# Altium schematic sheet [04] - RADIO.SchDoc
size A3; DocumentNumber: 4; SheetNumber: 4; SheetTotal: 8
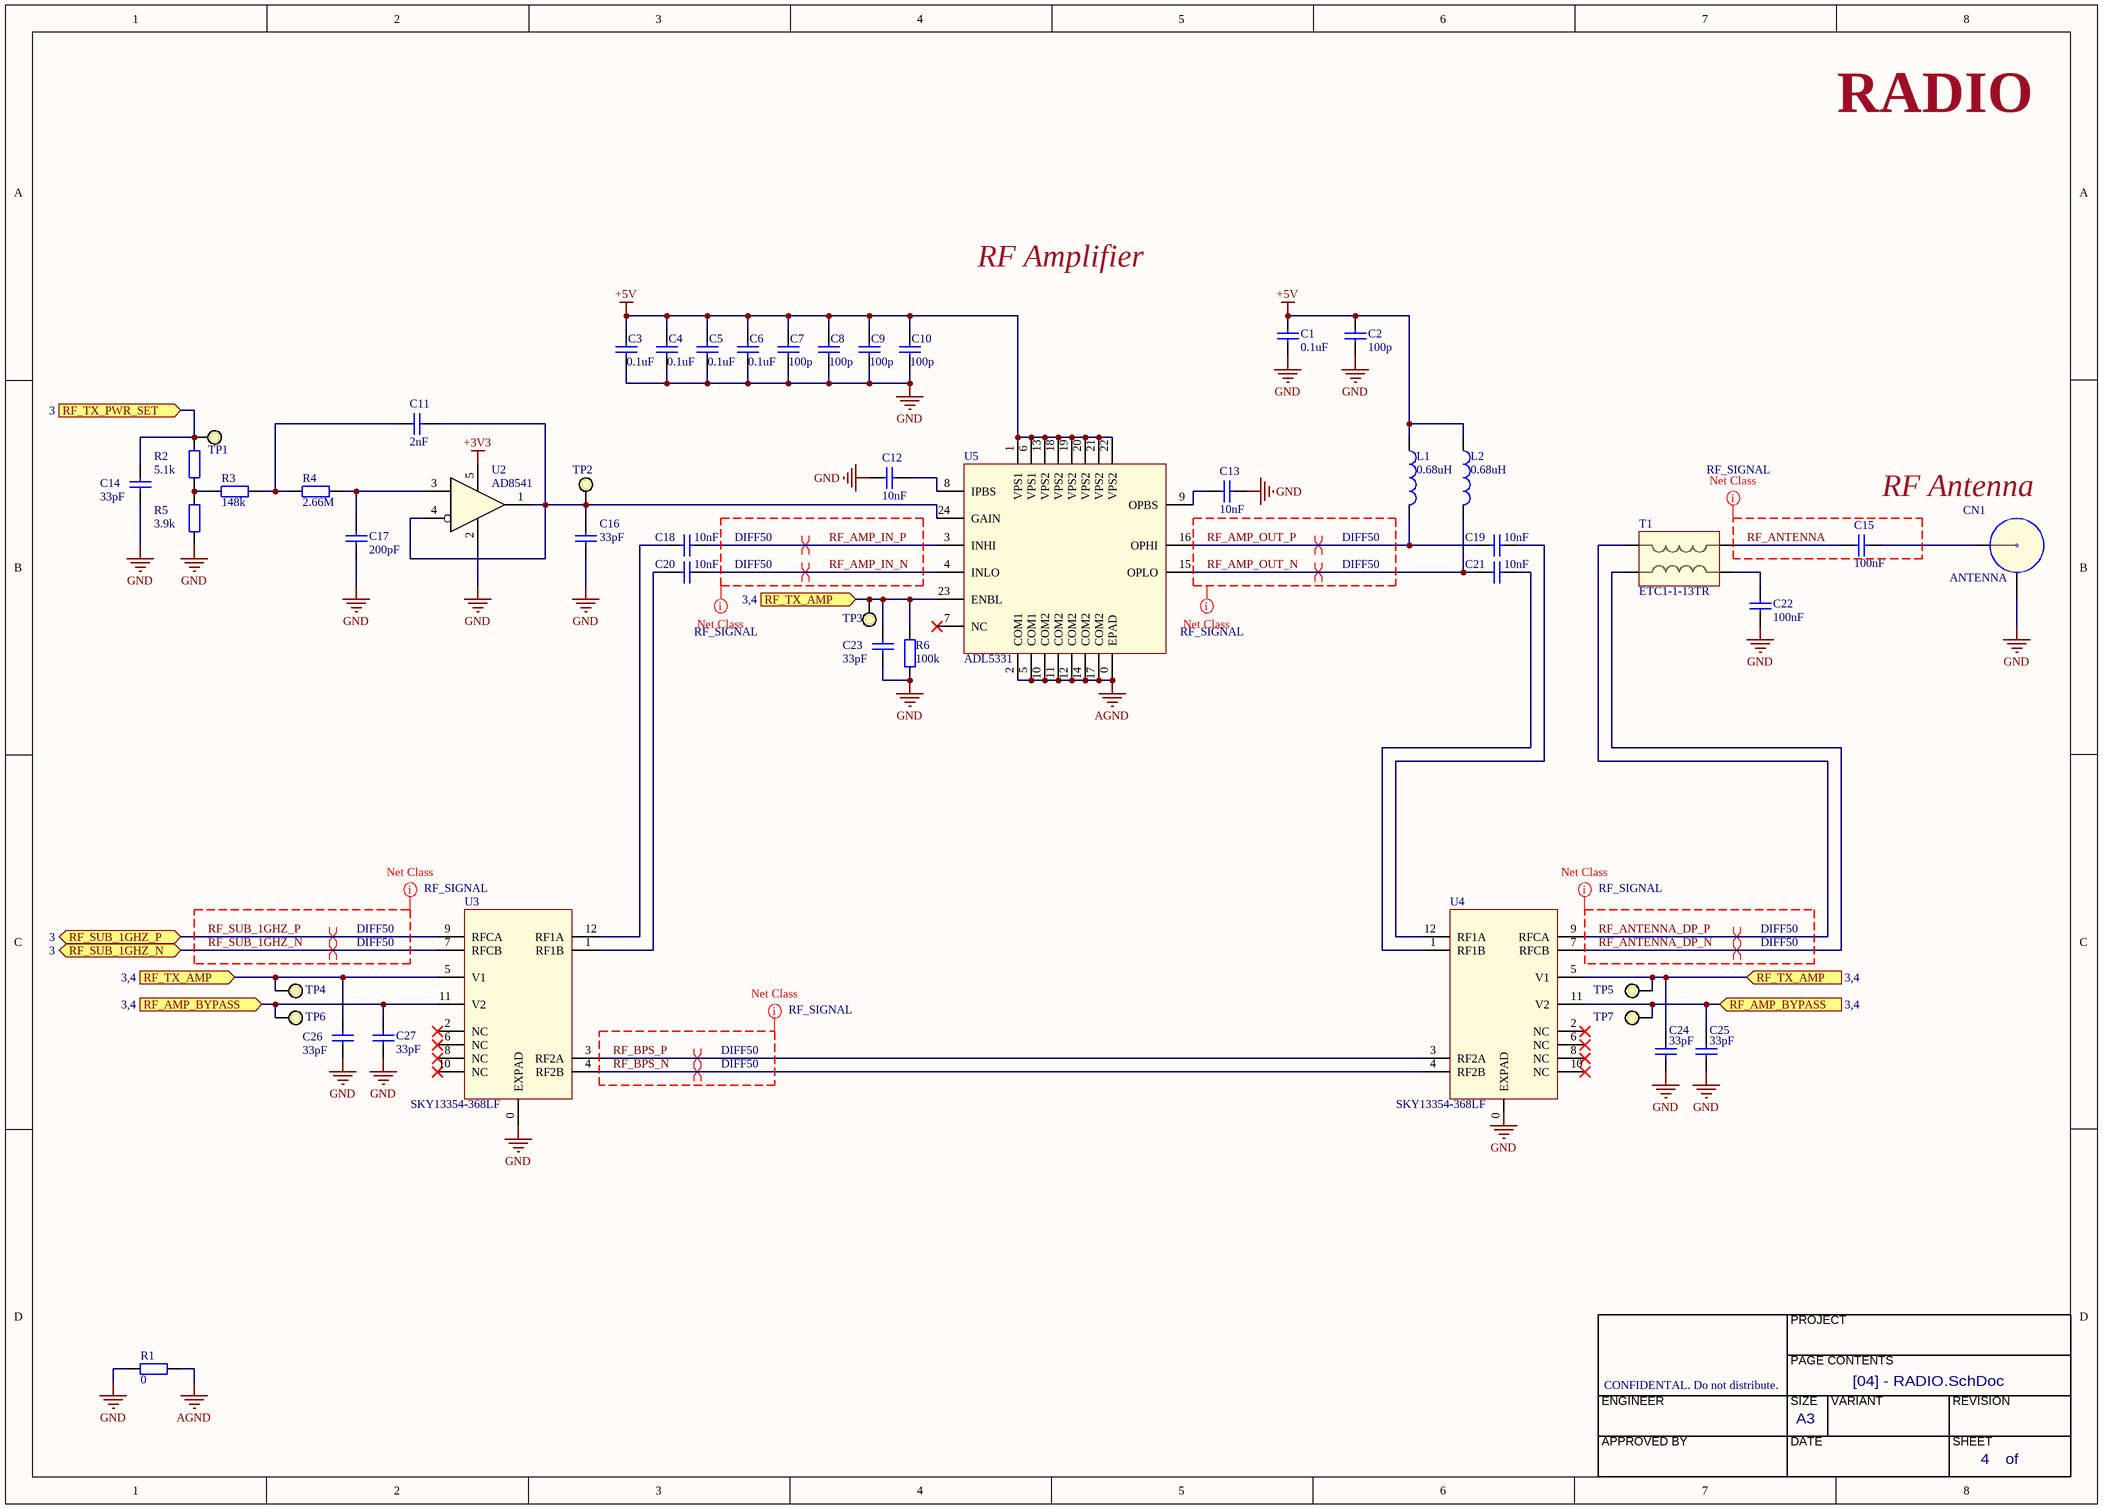
[diagram p0: [04] - RADIO.SchDoc]

## Parts
C1  0.1uF  [CAP0402]
C2  100p  [CAP0402]
C3  0.1uF  [CAP0402]
C4  0.1uF  [CAP0402]
C5  0.1uF  [CAP0402]
C6  0.1uF  [CAP0402]
C7  100p  [CAP0402]
C8  100p  [CAP0402]
C9  100p  [CAP0402]
C10  100p  [CAP0402]
C11  2nF  [CAP0402]
C12  10nF  [CAP0402]
C13  10nF  [CAP0402]
C14  33pF  [CAP0402]
C15  100nF  [CAP0402]
C16  33pF  [CAP0402]
C17  200pF  [CAP0402]
C18  10nF  [CAP0402]
C19  10nF  [CAP0402]
C20  10nF  [CAP0402]
C21  10nF  [CAP0402]
C22  100nF  [CAP0402]
C23  33pF  [CAP0402]
C24  33pF  [CAP0402]
C25  33pF  [CAP0402]
C26  33pF  [CAP0402]
C27  33pF  [CAP0402]
CN1  ANTENNA
L1  0.68uH  [INDC0603-0201]
L2  0.68uH  [INDC0603-0201]
R1  0  [RES0805]
R2  5.1k  [RES0805]
R3  148k  [RES0805]
R4  2.66M  [RES0805]
R5  3.9k  [RES0805]
R6  100k  [RES0805]
T1  ETC1-1-13TR
TP1  TestPoint  [TestPoint]  (value not drawn)  (no BOM)
TP2  TestPoint  [TestPoint]  (value not drawn)  (no BOM)
TP3  TestPoint  [TestPoint]  (value not drawn)  (no BOM)
TP4  TestPoint  [TestPoint]  (value not drawn)  (no BOM)
TP5  TestPoint  [TestPoint]  (value not drawn)  (no BOM)
TP6  TestPoint  [TestPoint]  (value not drawn)  (no BOM)
TP7  TestPoint  [TestPoint]  (value not drawn)  (no BOM)
U2  AD8541  [SOT23-5_PITCH0.95]
U3  SKY13354-368LF
U4  SKY13354-368LF
U5  ADL5331

## Ports
RF_AMP_BYPASS (in, see 3,4), RF_SUB_1GHZ_N (bidir, see 3), RF_SUB_1GHZ_P (bidir, see 3), RF_TX_AMP (in, see 3,4), RF_TX_PWR_SET (in, see 3)

## Nets
+3V3: U2.5(VCC+)
+5V: C1.1 C2.1 C3.1 C4.1 C5.1 C6.1 C7.1 C8.1 C9.1 C10.1 L1.1 L2.1 U5.1(VPS1) U5.6(VPS1) U5.13(VPS2) U5.18(VPS2) U5.19(VPS2) U5.20(VPS2) U5.21(VPS2) U5.22(VPS2)
AGND: R1.1 U5.0(EPAD) U5.2(COM1) U5.5(COM1) U5.10(COM2) U5.11(COM2) U5.12(COM2) U5.14(COM2) U5.17(COM2)
GND: C1.2 C2.2 C3.2 C4.2 C5.2 C6.2 C7.2 C8.2 C9.2 C10.2 C12.1 C13.1 C14.1 C16.1 C17.1 C22.1 C23.1 C24.1 C25.1 C26.1 C27.1 CN1.14 R1.2 R5.2 R6.1 U2.2(VCC-) U3.0(EXPAD)
RF_AMP_BYPASS: C25.2 C27.2 TP6.1 TP7.1 U3.11(V2) U4.11(V2) ; port RF_AMP_BYPASS
RF_AMP_IN_N: C20.1 U5.4(INLO)
RF_AMP_IN_P: C18.1 U5.3(INHI)
RF_AMP_OUT_N: C21.2 L2.2 U5.15(OPLO)
RF_AMP_OUT_P: C19.2 L1.2 U5.16(OPHI)
RF_ANTENNA: C15.2 T1.1(UP)
RF_ANTENNA_DP_N: T1.4(BP) U4.7(RFCB)
RF_ANTENNA_DP_P: T1.3(BP) U4.9(RFCA)
RF_BPS_N: U3.4(RF2B) U4.4(RF2B)
RF_BPS_P: U3.3(RF2A) U4.3(RF2A)
RF_SUB_1GHZ_N: U3.7(RFCB) ; port RF_SUB_1GHZ_N
RF_SUB_1GHZ_P: U3.9(RFCA) ; port RF_SUB_1GHZ_P
RF_TX_AMP: C23.2 C24.2 C26.2 R6.2 TP3.1 TP4.1 TP5.1 U3.5(V1) U4.5(V1) U5.23(ENBL) ; port RF_TX_AMP
RF_TX_PWR_SET: C14.2 R2.1 TP1.1 ; port RF_TX_PWR_SET
NetC11_1: C11.1 C16.2 TP2.1 U2.1(OUT) U2.4(IN-) U5.24(GAIN)
NetC11_2: C11.2 R3.1 R4.2
NetC12_2: C12.2 U5.8(IPBS)
NetC13_2: C13.2 U5.9(OPBS)
NetC15_1: C15.1 CN1.14
NetC17_2: C17.2 R4.1 U2.3(IN+)
NetC18_2: C18.2 U3.12(RF1A)
NetC19_1: C19.1 U4.12(RF1A)
NetC20_2: C20.2 U3.1(RF1B)
NetC21_1: C21.1 U4.1(RF1B)
NetC22_2: C22.2 T1.2(GND)
NetR2_2: R2.2 R3.2 R5.1

Not connected (* = marked no-connect by the designer): U3 2(NC)* 6(NC)* 8(NC)* 10(NC)*; U4 0(EXPAD) 2(NC)* 6(NC)* 8(NC)* 10(NC)*; U5 7(NC)*

## Layout directives
differential pair; net class DIFF50: RF_AMP_IN_N, RF_AMP_IN_P, RF_AMP_OUT_N, RF_AMP_OUT_P, RF_ANTENNA_DP_N, RF_ANTENNA_DP_P, RF_BPS_N, RF_BPS_P, RF_SUB_1GHZ_N, RF_SUB_1GHZ_P
net class RF_SIGNAL: RF_AMP_IN_N, RF_AMP_IN_P, RF_AMP_OUT_N, RF_AMP_OUT_P, RF_ANTENNA, RF_ANTENNA_DP_N, RF_ANTENNA_DP_P, RF_BPS_N, RF_BPS_P, RF_SUB_1GHZ_N, RF_SUB_1GHZ_P

## Notes on the sheet
- RADIO
- RF Amplifier
- RF Antenna
- PROJECT
- CONFIDENTAL. Do not distribute.
- PAGE CONTENTS
- ENGINEER
- APPROVED BY
- SIZE
- DATE
- A3
- VARIANT
- REVISION
- SHEET
- of
- Labels drawn without touching a wire or pin: GND

## Library data of the parts
C1-C27 = Cap: Capacitor; Manufacturer: *; Manufacturer Part Number: *; Supplier 1: Digi-Key; Supplier Part Number 1: *
CN1 = SMC
L1 L2 = Inductor: DigiKey: *
R1-R6 = Res: Resistor; Manufacturer: *; Manufacturer Part Number: *; Supplier 1: Digi-Key; Supplier Part Number 1: *
T1 = balun_0433BM15A0001E
U2 = OPAMP x1